# EAGLE schematic driver_board_v2 (EAGLE 6.5.0)
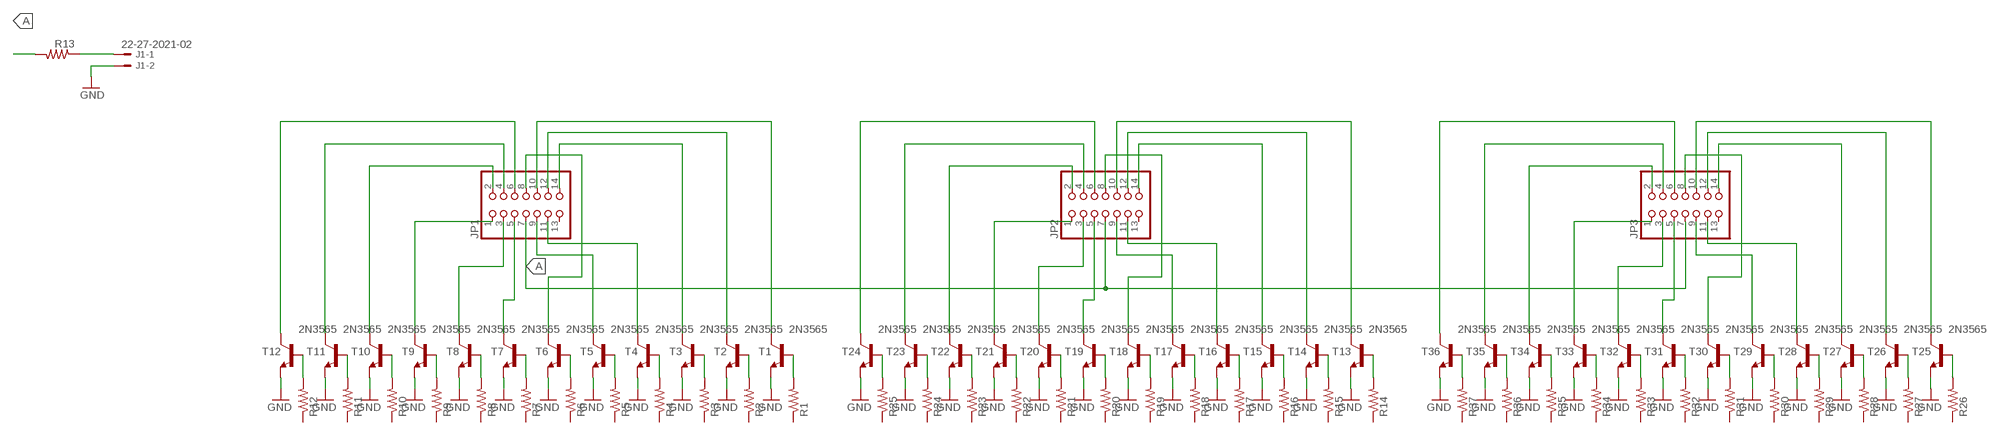
[diagram p0: schematic, sheet 1]

## Parts
J1  22-27-2021-02  [6410-02]
JP1  PINHD-2X7  [2X07]
JP2  PINHD-2X7  [2X07]
JP3  PINHD-2X7  [2X07]
R1  R-US_0204/7  [0204/7]
R2  R-US_0204/7  [0204/7]
R3  R-US_0204/7  [0204/7]
R4  R-US_0204/7  [0204/7]
R5  R-US_0204/7  [0204/7]
R6  R-US_0204/7  [0204/7]
R7  R-US_0204/7  [0204/7]
R8  R-US_0204/7  [0204/7]
R9  R-US_0204/7  [0204/7]
R10  R-US_0204/7  [0204/7]
R11  R-US_0204/7  [0204/7]
R12  R-US_0204/7  [0204/7]
R13  R-US_0204/7  [0204/7]
R14  R-US_0204/7  [0204/7]
R15  R-US_0204/7  [0204/7]
R16  R-US_0204/7  [0204/7]
R17  R-US_0204/7  [0204/7]
R18  R-US_0204/7  [0204/7]
R19  R-US_0204/7  [0204/7]
R20  R-US_0204/7  [0204/7]
R21  R-US_0204/7  [0204/7]
R22  R-US_0204/7  [0204/7]
R23  R-US_0204/7  [0204/7]
R24  R-US_0204/7  [0204/7]
R25  R-US_0204/7  [0204/7]
R26  R-US_0204/7  [0204/7]
R27  R-US_0204/7  [0204/7]
R28  R-US_0204/7  [0204/7]
R29  R-US_0204/7  [0204/7]
R30  R-US_0204/7  [0204/7]
R31  R-US_0204/7  [0204/7]
R32  R-US_0204/7  [0204/7]
R33  R-US_0204/7  [0204/7]
R34  R-US_0204/7  [0204/7]
R35  R-US_0204/7  [0204/7]
R36  R-US_0204/7  [0204/7]
R37  R-US_0204/7  [0204/7]
T1  2N3565  [TO92]
T2  2N3565  [TO92]
T3  2N3565  [TO92]
T4  2N3565  [TO92]
T5  2N3565  [TO92]
T6  2N3565  [TO92]
T7  2N3565  [TO92]
T8  2N3565  [TO92]
T9  2N3565  [TO92]
T10  2N3565  [TO92]
T11  2N3565  [TO92]
T12  2N3565  [TO92]
T13  2N3565  [TO92]
T14  2N3565  [TO92]
T15  2N3565  [TO92]
T16  2N3565  [TO92]
T17  2N3565  [TO92]
T18  2N3565  [TO92]
T19  2N3565  [TO92]
T20  2N3565  [TO92]
T21  2N3565  [TO92]
T22  2N3565  [TO92]
T23  2N3565  [TO92]
T24  2N3565  [TO92]
T25  2N3565  [TO92]
T26  2N3565  [TO92]
T27  2N3565  [TO92]
T28  2N3565  [TO92]
T29  2N3565  [TO92]
T30  2N3565  [TO92]
T31  2N3565  [TO92]
T32  2N3565  [TO92]
T33  2N3565  [TO92]
T34  2N3565  [TO92]
T35  2N3565  [TO92]
T36  2N3565  [TO92]

## Nets
A: JP1.7 JP2.7 JP3.7 R13.2
GND: J1.2 T1.3(E) T2.3(E) T3.3(E) T4.3(E) T5.3(E) T6.3(E) T7.3(E) T8.3(E) T9.3(E) T10.3(E) T11.3(E) T12.3(E) T13.3(E) T14.3(E) T15.3(E) T16.3(E) T17.3(E) T18.3(E) T19.3(E) T20.3(E) T21.3(E) T22.3(E) T23.3(E) T24.3(E) T25.3(E) T26.3(E) T27.3(E) T28.3(E) T29.3(E) T30.3(E) T31.3(E) T32.3(E) T33.3(E) T34.3(E) T35.3(E) T36.3(E)
N$1: R12.2 T12.2(B)
N$2: R11.2 T11.2(B)
N$3: R10.2 T10.2(B)
N$4: R9.2 T9.2(B)
N$5: R8.2 T8.2(B)
N$6: R7.2 T7.2(B)
N$7: R6.2 T6.2(B)
N$8: R5.2 T5.2(B)
N$9: R4.2 T4.2(B)
N$10: R3.2 T3.2(B)
N$11: R2.2 T2.2(B)
N$12: R1.2 T1.2(B)
N$13: JP1.6 T12.1(C)
N$14: JP1.4 T11.1(C)
N$15: JP1.2 T10.1(C)
N$16: JP1.1 T9.1(C)
N$17: JP1.3 T8.1(C)
N$18: JP1.5 T7.1(C)
N$19: JP1.10 T1.1(C)
N$20: JP1.12 T2.1(C)
N$21: JP1.14 T3.1(C)
N$22: JP1.8 T6.1(C)
N$23: JP1.9 T5.1(C)
N$24: JP1.11 T4.1(C)
N$25: J1.1 R13.1
N$26: R25.2 T24.2(B)
N$27: R24.2 T23.2(B)
N$28: R23.2 T22.2(B)
N$29: R22.2 T21.2(B)
N$30: R21.2 T20.2(B)
N$31: R20.2 T19.2(B)
N$32: R19.2 T18.2(B)
N$33: R18.2 T17.2(B)
N$34: R17.2 T16.2(B)
N$35: R16.2 T15.2(B)
N$36: R15.2 T14.2(B)
N$37: R14.2 T13.2(B)
N$38: JP2.6 T24.1(C)
N$39: JP2.4 T23.1(C)
N$40: JP2.2 T22.1(C)
N$41: JP2.1 T21.1(C)
N$42: JP2.3 T20.1(C)
N$43: JP2.5 T19.1(C)
N$44: JP2.10 T13.1(C)
N$45: JP2.12 T14.1(C)
N$46: JP2.14 T15.1(C)
N$47: JP2.8 T18.1(C)
N$48: JP2.9 T17.1(C)
N$49: JP2.11 T16.1(C)
N$50: R37.2 T36.2(B)
N$51: R36.2 T35.2(B)
N$52: R35.2 T34.2(B)
N$53: R34.2 T33.2(B)
N$54: R33.2 T32.2(B)
N$55: R32.2 T31.2(B)
N$56: R31.2 T30.2(B)
N$57: R30.2 T29.2(B)
N$58: R29.2 T28.2(B)
N$59: R28.2 T27.2(B)
N$60: R27.2 T26.2(B)
N$61: R26.2 T25.2(B)
N$62: JP3.6 T36.1(C)
N$63: JP3.4 T35.1(C)
N$64: JP3.2 T34.1(C)
N$65: JP3.1 T33.1(C)
N$66: JP3.3 T32.1(C)
N$67: JP3.5 T31.1(C)
N$68: JP3.10 T25.1(C)
N$69: JP3.12 T26.1(C)
N$70: JP3.14 T27.1(C)
N$71: JP3.8 T30.1(C)
N$72: JP3.9 T29.1(C)
N$73: JP3.11 T28.1(C)
Unconnected: JP1.13 JP2.13 JP3.13 R1.1 R2.1 R3.1 R4.1 R5.1 R6.1 R7.1 R8.1 R9.1 R10.1 R11.1 R12.1 R14.1 R15.1 R16.1 R17.1 R18.1 R19.1 R20.1 R21.1 R22.1 R23.1 R24.1 R25.1 R26.1 R27.1 R28.1 R29.1 R30.1 R31.1 R32.1 R33.1 R34.1 R35.1 R36.1 R37.1

## Library data of the parts
J1 = con-molex:22-?-02: CONNECTOR wire to board 2.54 mm (.1 inch) pitch header; OC_FARNELL: unknown; OC_NEWARK: unknown
JP1-JP3 = pinhead:PINHD-2X7: PIN HEADER
R1-R37 = resistor:R-US_: RESISTOR, American symbol
T1-T36 = transistor:2N3565: NPN TRANSISTOR